# EasyEDA schematic TCRT5000-Driver.json
TITLE: Sheet_1; REV: 1.0; Date: 2024-02-21; Sheet: 1/1; Company: Your Company
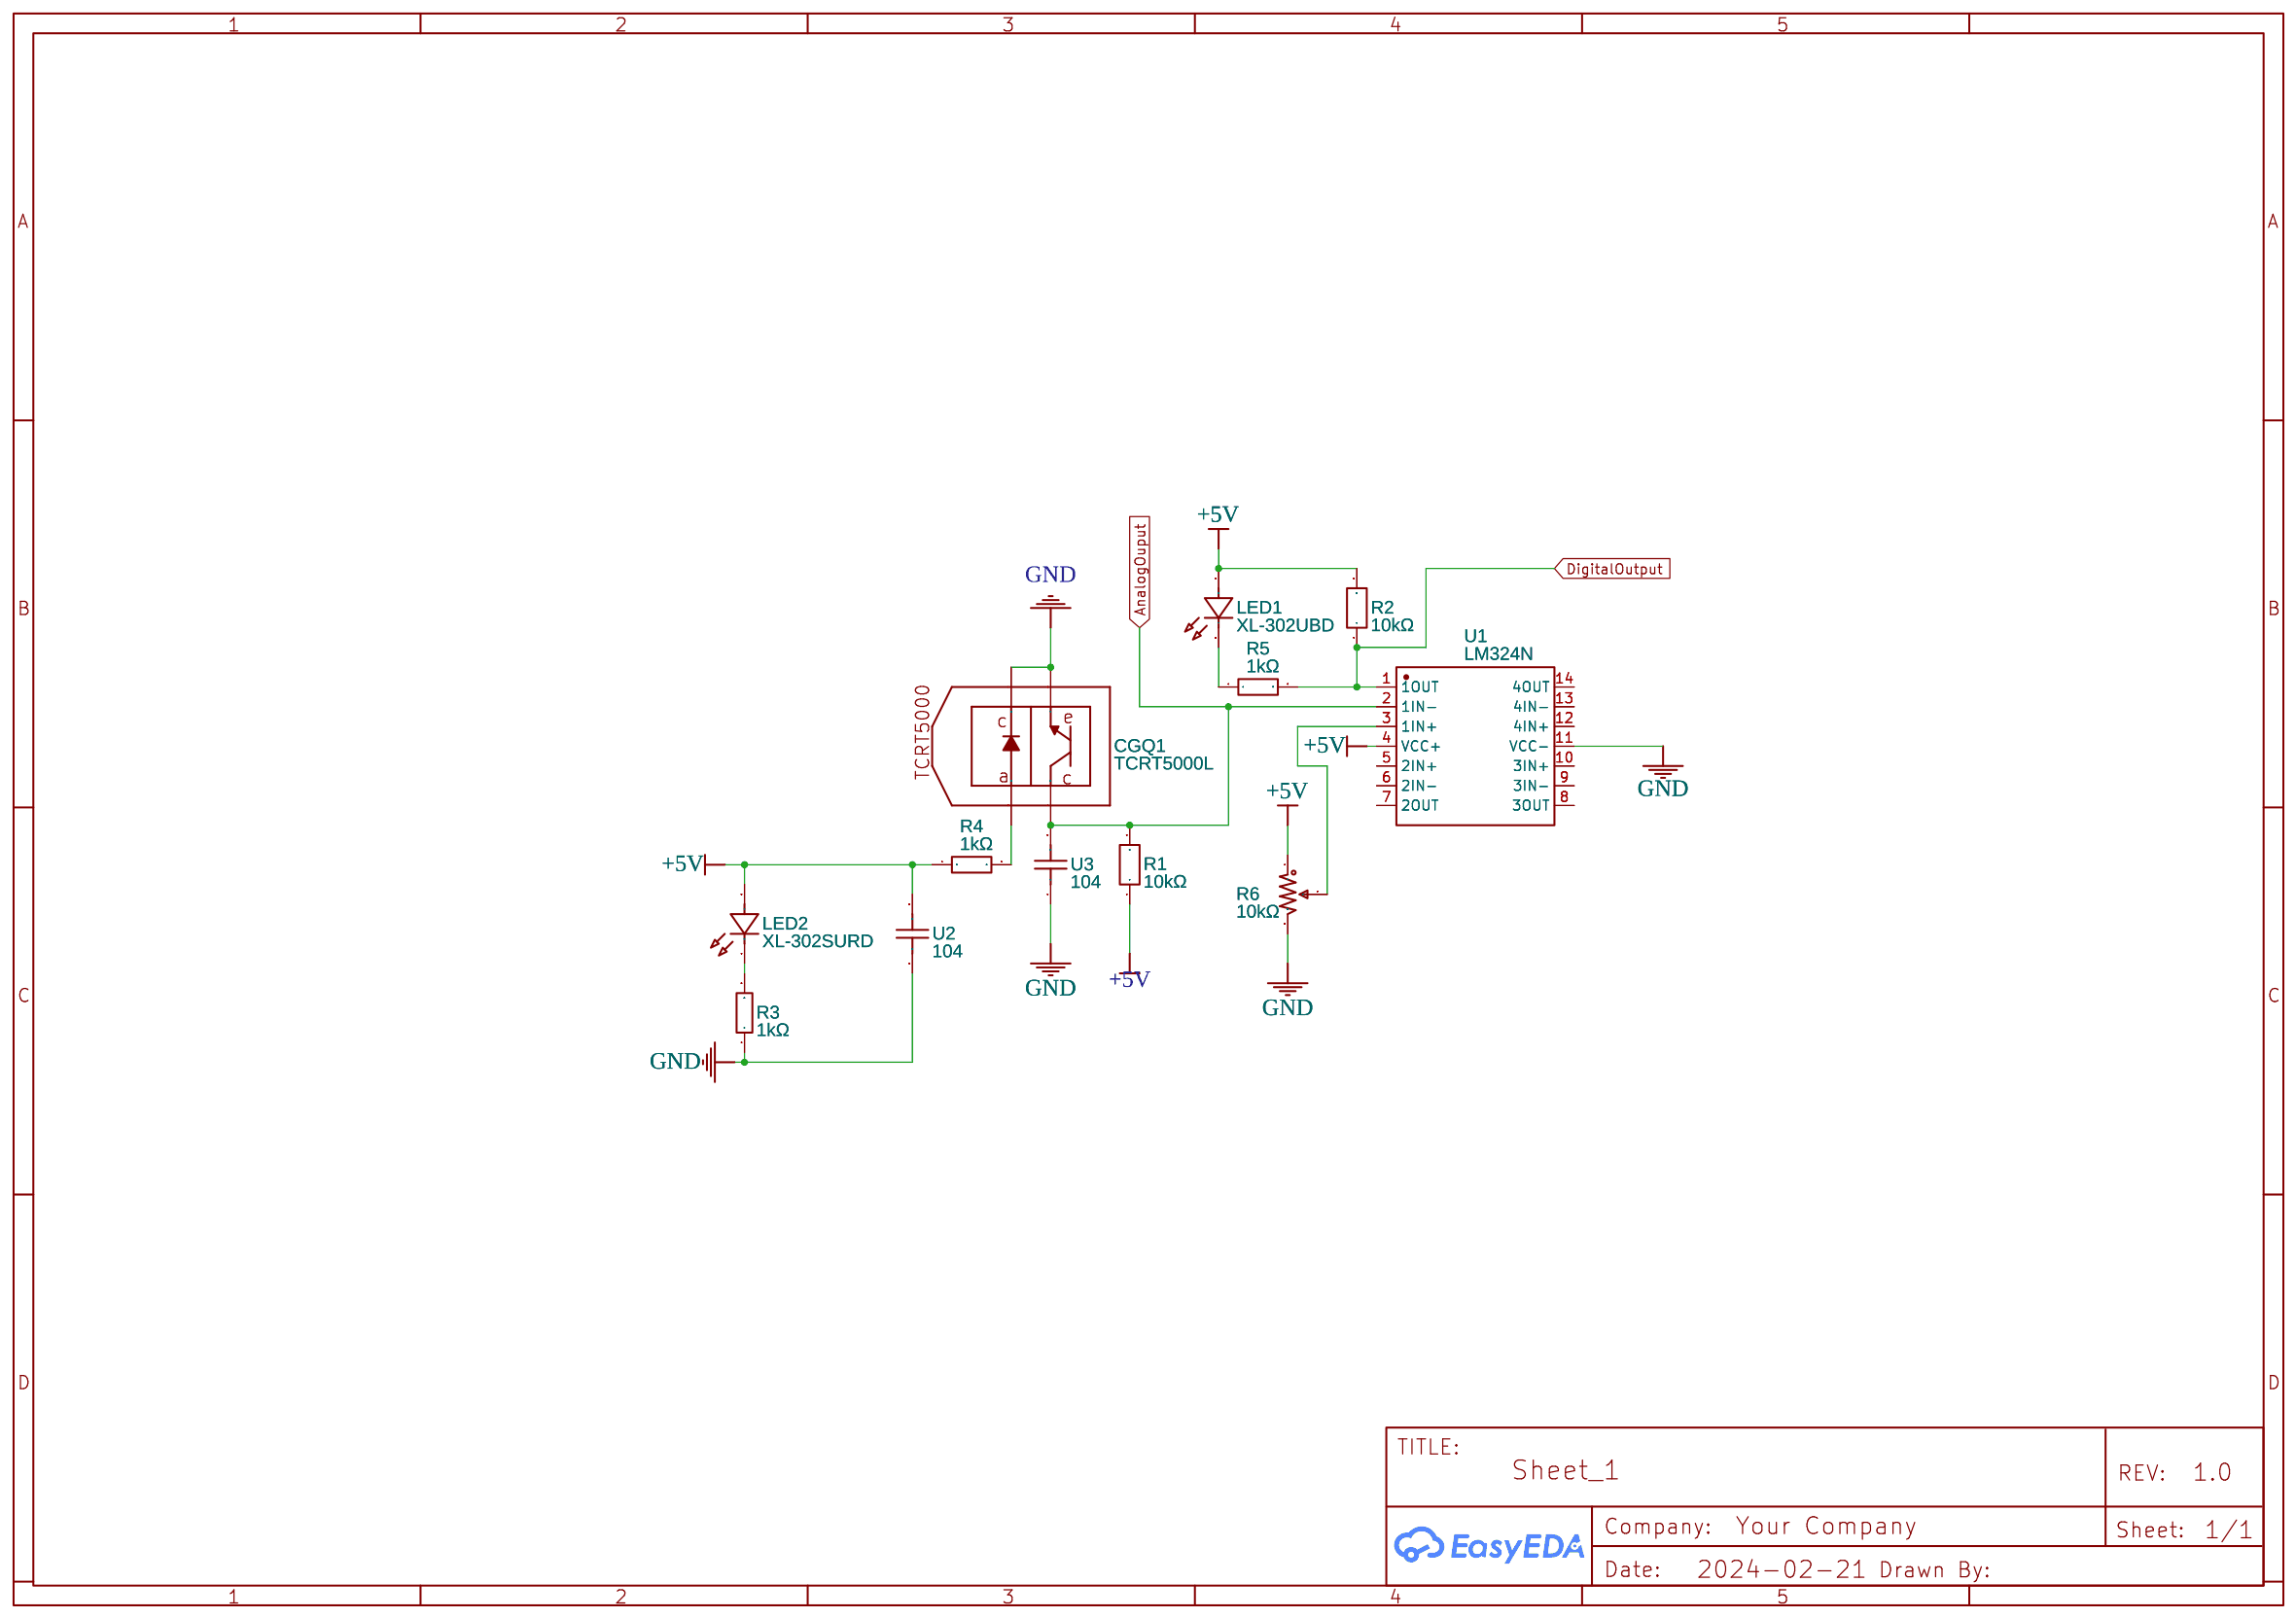
[diagram p0: schematic sheet]

## Parts
CGQ1  TCRT5000L  [OPTO-TH_TCRT5000L]
LED1  XL-302UBD  [LED-TH_BD3.8-P2.54-FD_BLUE]
LED2  XL-302SURD  [LED-TH_BD3.8-P2.54-RD]
R1  10kΩ  [RES-TH_BD2.4-L6.3-P10.30-D0.6]
R2  10kΩ  [RES-TH_BD2.4-L6.3-P10.30-D0.6]
R3  1kΩ  [RES-TH_BD2.7-L6.2-P10.20-D0.4]
R4  1kΩ  [RES-TH_BD2.7-L6.2-P10.20-D0.4]
R5  1kΩ  [RES-TH_BD2.7-L6.2-P10.20-D0.4]
R6  10kΩ  [RES-ADJ-SMD_RM065-V1]
U1  LM324N  [DIP-14_L19.3-W7.0-P2.54-LS7.6-BL]
U2  104  [CAP-TH_L5.8-W2.8]
U3  104  [CAP-TH_L5.8-W2.8]

## Library data of the parts
CGQ1 = TCRT5000L: Supplier: LCSC; Manufacturer: VISHAY(威世); Supplier Part: C24085; JLCPCB Part Class: Extended Part
LED1 = XL-302UBD: Contributor: LCSC; Supplier: LCSC; Supplier Part: C2895474; Manufacturer: XINGLIGHT(成兴光); JLCPCB Part Class: Extended Part
LED2 = XL-302SURD: Contributor: LCSC; Supplier: LCSC; Supplier Part: C2895470; Manufacturer: XINGLIGHT(成兴光); JLCPCB Part Class: Extended Part
R1 R2 = RD 1/4W 10K J T/B A1: Contributor: LCSC; Supplier: LCSC; Supplier Part: C433778; Manufacturer: Tyohm(幸亚电阻); Manufacturer Part: RD1/4W10KJT/BA1; JLCPCB Part Class: Extended Part
R3-R5 = CR1/4W-1K±5%-ST26: Contributor: LCSC; Supplier: LCSC; Supplier Part: C2894606; Manufacturer: VO(翔胜); JLCPCB Part Class: Extended Part
R6 = RM065-103(10K): Supplier: LCSC; Supplier Part: C5205021; Manufacturer: BOCHEN(博晨); Contributor: lcsc
U1 = LM324N: Contributor: LCSC; Supplier: LCSC; Manufacturer: TI(德州仪器); Supplier Part: C114380; JLCPCB Part Class: Extended Part
U2 U3 = CC1H104MC1FD3F6C10SA: Contributor: lcsc; Supplier: LCSC; Supplier Part: C5375966; Manufacturer: Dersonic(德尔创)

## Nets
+5V: LED1.1(K) LED2.2(A) R1.1 R2.2 R4.1 R6.1 U1.4(VCC+) U2.2
GND: CGQ1.2(E) CGQ1.4(C) R3.1 R6.3 U1.11(VCC-) U2.1 U3.1
AnalogOuput: CGQ1.1(C) R1.2 U1.2(1IN-) U3.2
DigitalOutput: R2.1 R5.2 U1.1(1OUT)
Net-(CGQ1-3): CGQ1.3(A) R4.2
Net-(LED1-2): LED1.2(A) R5.1
Net-(LED2-1): LED2.1(K) R3.2
Net-(R6-2): R6.2 U1.3(1IN+)

Not connected (* = marked no-connect by the designer): U1 5(2IN+) 6(2IN-) 7(2OUT) 8(3OUT) 9(3IN-) 10(3IN+) 12(4IN+) 13(4IN-) 14(4OUT)
